# EAGLE design padsSMD (EAGLE 9.6.2)
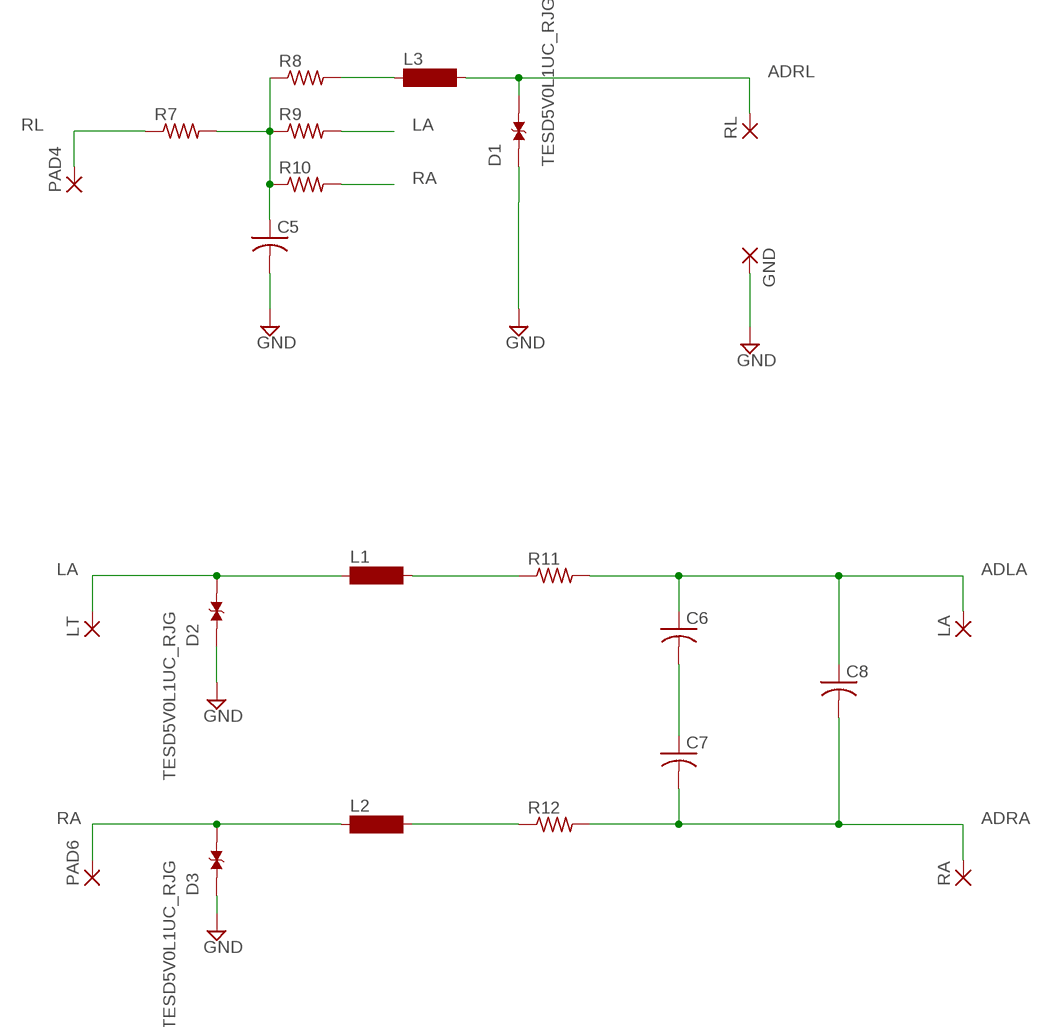
[diagram p0: schematic, sheet 1]

## Parts
C5  C-USC1206  [C1206]
C6  C-USC1206  [C1206]
C7  C-USC1206  [C1206]
C8  C-USC1206  [C1206]
D1  TESD5V0L1UC_RJG  [DIO_TESD5V0L1UC_RJG]
D2  TESD5V0L1UC_RJG  [DIO_TESD5V0L1UC_RJG]
D3  TESD5V0L1UC_RJG  [DIO_TESD5V0L1UC_RJG]
GND  2,15/1,0  [2,15/1,0]
L1  SM-1206  [SM-1206]
L2  SM-1206  [SM-1206]
L3  SM-1206  [SM-1206]
LA  2,15/1,0  [2,15/1,0]
LT  SMD5  [SMD2,54-5,08]
PAD4  SMD5  [SMD2,54-5,08]
PAD6  SMD5  [SMD2,54-5,08]
R7  R-US_R1206  [R1206]
R8  R-US_R1206  [R1206]
R9  R-US_R1206  [R1206]
R10  R-US_R1206  [R1206]
R11  R-US_R1206  [R1206]
R12  R-US_R1206  [R1206]
RA  2,15/1,0  [2,15/1,0]
RL  2,15/1,0  [2,15/1,0]

## Nets
ADLA: C6.1 C8.1 LA.1(P) R11.2
ADRA: C7.2 C8.2 R12.2 RA.1(P)
ADRL: D1.2 L3.2 RL.1(P)
GND: C5.2 D1.1 D2.1 D3.1 GND.1(P)
LA: D2.2 L1.1 LT.1(P) R9.2
N$1: C5.1 R7.2 R8.1 R9.1 R10.1
N$3: L3.1 R8.2
N$8: L1.2 R11.1
N$10: C6.2 C7.1
N$12: L2.2 R12.1
RA: D3.2 L2.1 PAD6.1(P) R10.2
RL: PAD4.1(P) R7.1

## Library data of the parts
C5-C8 = adafruit:C-US: CAPACITOR, American symbol
D1-D3 = TESD5V0L1UC_RJG:TESD5V0L1UC_RJG: Check availability <https://pricing.snapeda.com/parts/TESD5V0L1UC%20RJG/Taiwan%20Semiconductor%20Corporation/view-part?ref=eda>; AVAILABILITY: In Stock; DESCRIPTION: DFN1006L, 5V, 100W, 2pF, ESD Protection Diode & Array; MF: Taiwan Semiconductor Corporation; MP: TESD5V0L1UC RJG; PACKAGE: DFN1006L Taiwan Semiconductor; PRICE: None; PURCHASE-URL: https://pricing.snapeda.com/search/part/TESD5V0L1UC RJG/?ref=eda
GND LA RA RL = wirepad:2,15/1,0: THROUGH-HOLE PAD
L1-L3 = inductor-neosid:SM-1206: INDUCTOR SMD chip inductor; OC_FARNELL: unknown; OC_NEWARK: unknown
LT PAD4 PAD6 = wirepad:SMD5: SMD PAD
R7-R12 = adafruit:R-US_: RESISTOR, American symbol

## Net classes
0 default: clearance 0.762 mm

## Board
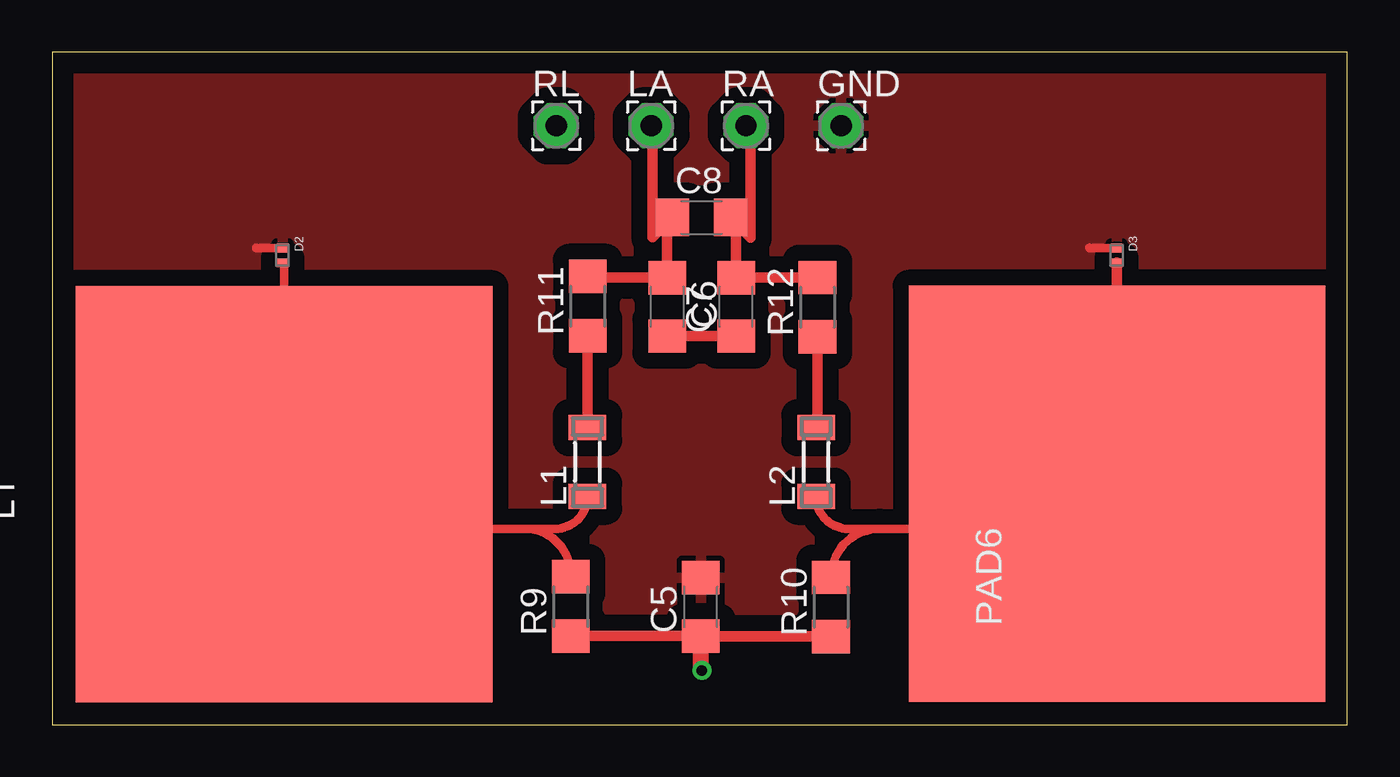
[diagram p1: board, top side]
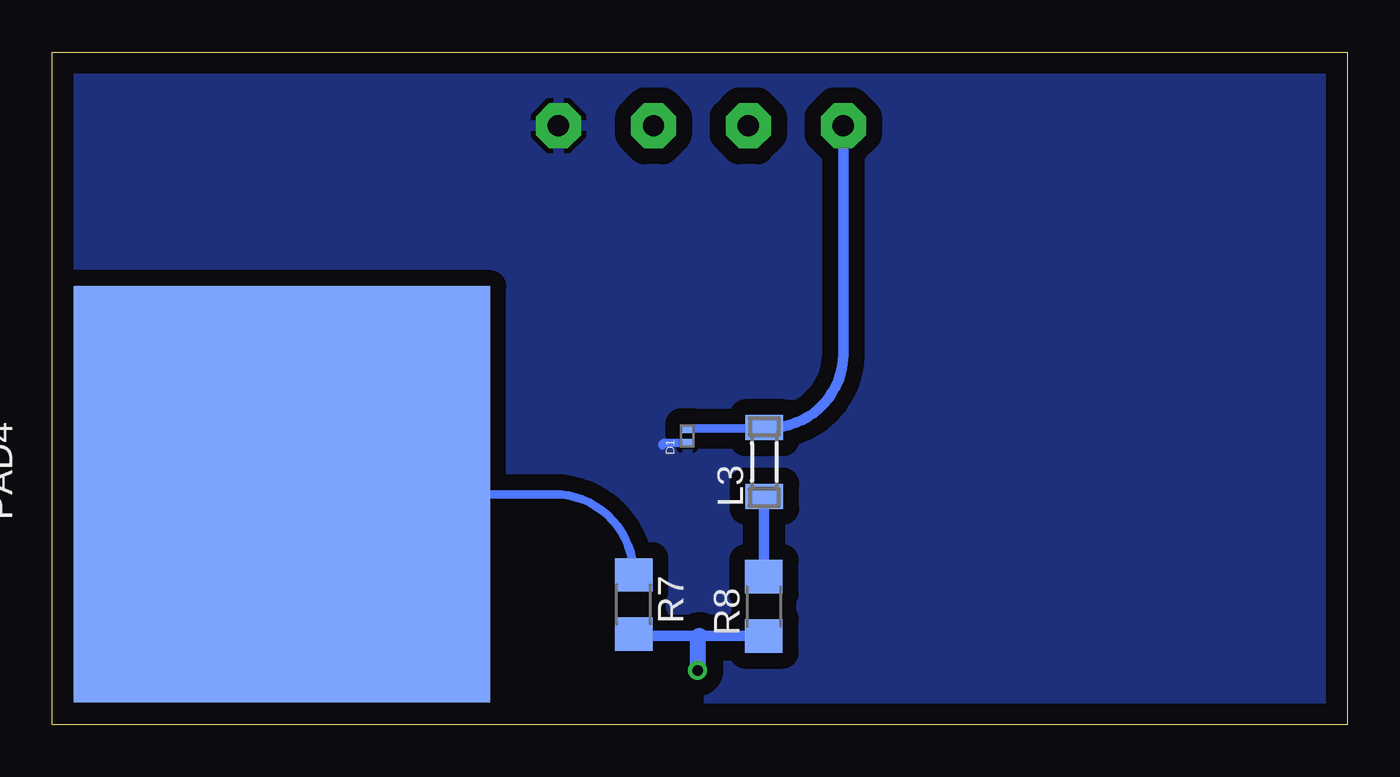
[diagram p2: board, bottom side, seen from below]

Size 62.2 x 32.3 mm. Coordinates in mm from the lower left corner, seen from the top.
Outline: 0,0 62.2,0 62.2,32.3 0,32.3 0,0
Copper layers (1*16): Top 0.035mm / dielectric 1.5mm / Bottom 0.035mm
Design rules "default *": minimum track width 6mil, minimum drill 0.35mm, track to track 12mil, track to pad 12mil, pad to pad 12mil, via to via 12mil, smd to smd 12mil, copper to edge 40mil, drill to drill 12mil, minimum pad ring 10mil, minimum via ring 8mil, stop-mask expansion 4mil, vias tented up to drill 0mil, thermal gap 10mil

### Footprints (pad centres in the part's own frame; a part is rotated, then mirrored left to right if it is on the bottom)
C1206 = smd 1.6 x 1.8: 1 -1.4,0; 2 1.4,0
DIO_TESD5V0L1UC_RJG = smd 0.41 x 0.56: 1 -0.35,0; 2 0.35,0
2,15/1,0 = drill 1.016 pad 2.159 octagon: 1 0,0
SM-1206 = smd 1.2 x 1.8: 1 -1.65,0; 2 1.65,0
SMD2,54-5,08 = smd 20 x 20: 1 0,0
R1206 = smd 1.6 x 1.803: 1 -1.422,0; 2 1.422,0

### Placement (x,y rotation side)
C5  31.15,5.65 90 top
C6  29.53,20.06 270 top
C7  32.84,20.06 90 top
C8  31.18,24.35 0 top
D1  31.7,13.87 90 bottom
D2  11.07,22.54 270 top
D3  51.12,22.54 270 top
GND  37.89,28.76 0 top
L1  25.71,12.61 90 top
L2  36.69,12.61 90 top
L3  28,12.61 90 bottom
LA  28.77,28.76 0 top
LT  11.14,11.06 0 top
PAD4  51.16,11.06 0 bottom
PAD6  51.14,11.08 0 top
R7  34.27,5.77 270 bottom
R8  28.03,5.68 90 bottom
R9  24.9,5.68 90 top
R10  37.4,5.65 90 top
R11  25.72,20.1 90 top
R12  36.75,20.05 90 top
RA  33.32,28.76 0 top
RL  24.21,28.76 0 top

### Tracks (layer width: path | path; a pad name or v marks a point on that pad's centre or on a via)
ADLA
  Top 0.508: LA.1 arc-90 28.83,28.7 28.83,23.4 29.53,24.1 | 29.53,24.1 C6.1 25.78,21.46 arc90 R11.2 | 29.53,24.1 arc-90 C8.1
ADRA
  Top 0.508: R12.2 32.85,21.47 C7.2 32.84,24.09 | RA.1 arc-90 33.54,28.54 33.54,23.39 32.84,24.09 | 32.84,24.09 arc90 C8.2
ADRL
  Bottom 0.406: D1.2 28.05,14.21 arc-90 L3.2
  Bottom 0.508: RL.1 24.21,17.8 arc90 27.75,14.26 L3.2
GND
  Top 0.406: D2.1 9.81,22.89 arc-90 9.8,22.9 | D3.1 49.82,22.89 arc-90 49.8,22.9
  Bottom 0.406: D1.1 32.78,13.51 arc-90 32.9,13.4
  pour Top: 0,32.3 0,0.2 62.1,0.2 62.1,32.3
  pour Bottom: 0,32.3 0,0.1 62,0.1 62,32.3
LA
  Top 0.406: L1.1 arc-90 24.15,9.4 22.7,9.4 | 22.7,9.4 12.8,9.4 arc-90 LT.1 11.14,22.12 arc90 D2.2 | R9.2 24.9,7.2 arc90 22.7,9.4
N$1  (via drill 0.5 pad 0.8)
  Top 0.508: R10.1 31.17,4.23 | 31.17,4.23 arc-90 C5.1 R9.1 arc-90 R9.1 C5.1 arc-90 31.17,4.23
  Top 0.762: v31.2,2.6 arc-90 31.17,2.63 31.17,4.23
  Bottom 0.508: R8.1 31.1,4.25 34.19,4.25 arc90 R7.2
  Bottom 0.762: 31.1,4.25 arc-90 31.2,4.15 v31.2,2.6
N$3
  Bottom 0.508: R8.2 28.03,10.94 arc90 L3.1
N$8
  Top 0.508: R11.1 L1.2
N$10
  Top 0.508: C6.2 C7.1
N$12
  Top 0.508: R12.1 36.75,14.32 arc-90 L2.2
RA
  Top 0.406: L2.1 arc90 38.25,9.4 39.73,9.4 | 51.12,11.1 51.12,10.32 arc-90 50.2,9.4 40.9,9.4 39.73,9.4 | R10.2 arc-90 39.73,9.4
  Top 0.508: D3.2 51.12,11.1 arc90 PAD6.1
RL
  Bottom 0.406: R7.1 34.27,7.22 arc-90 38.12,11.06 PAD4.1